# Altium project Portable_power_supply_v1.PrjPcb
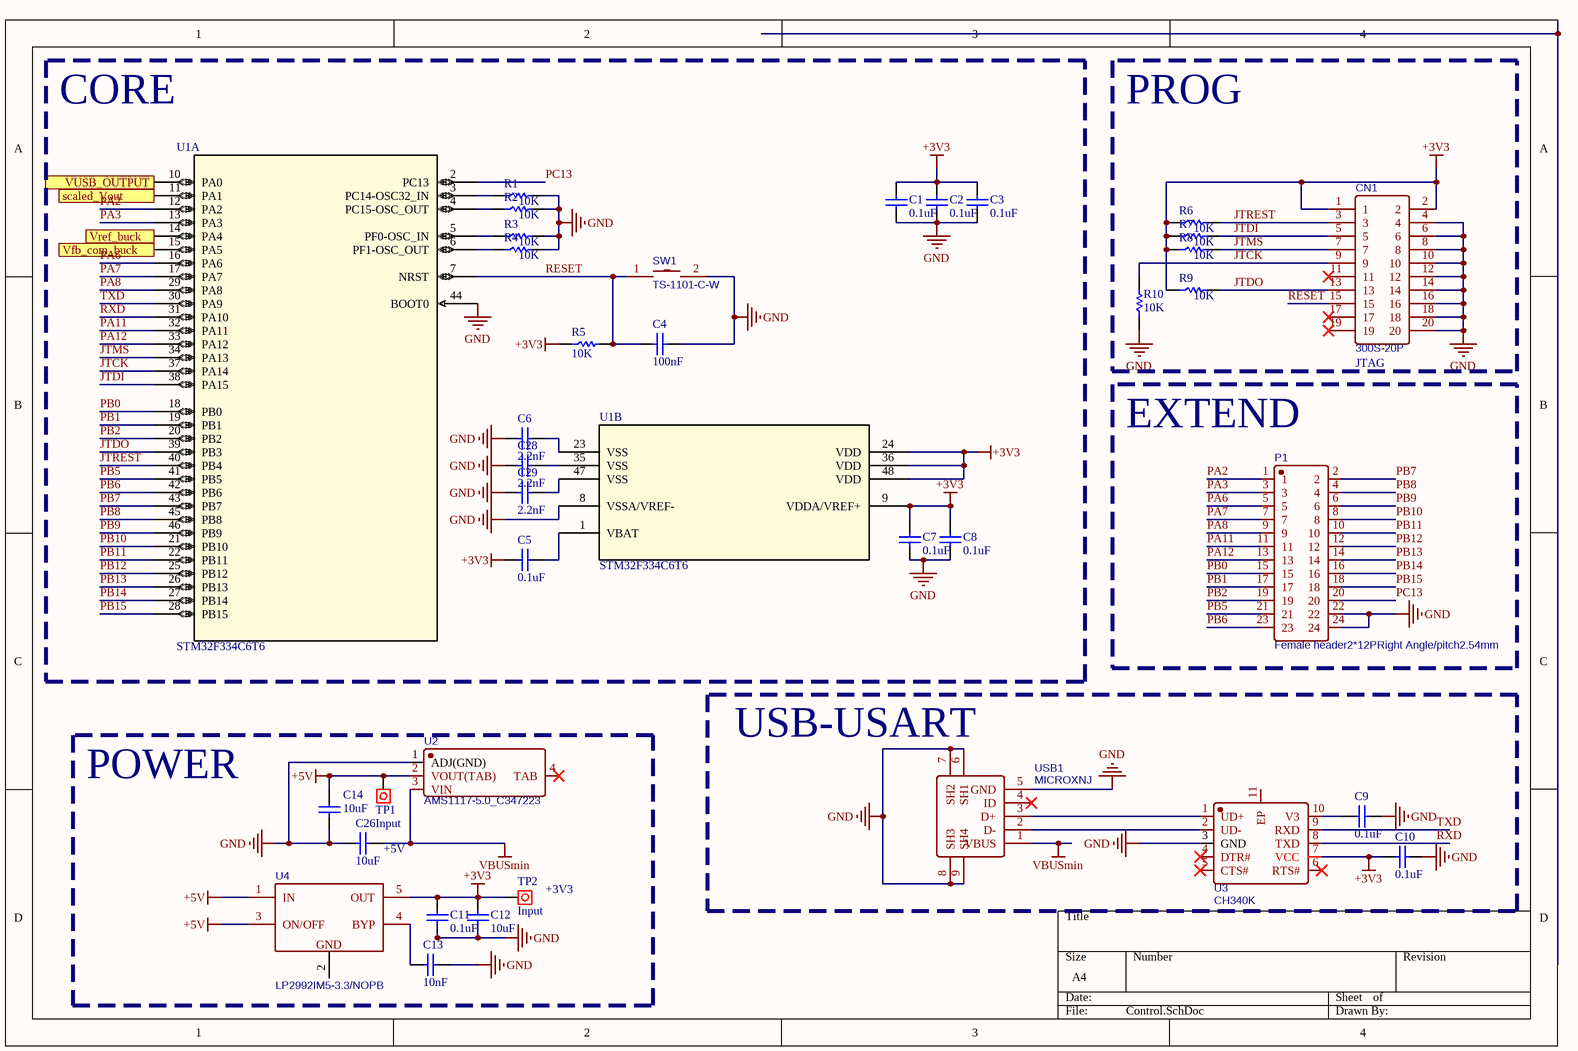
[diagram p0: Control.SchDoc]
4 sheets, 111 parts. Net scope: flat (ports and power ports of the same name join across sheets).
Board file: Portable power supply version2.PcbDoc
Sheets:
  Control.SchDoc
  Front(LDR).SchDoc
  BoostRegulator.SchDoc
  Buck_CurrentRegulator.SchDoc

## Sheet Control.SchDoc
size A4; SheetNumber: 1; SheetTotal: 4

### Parts
C1  0.1uF  [0805C]
C2  0.1uF  [0805C]
C3  0.1uF  [0805C]
C4  100nF  [0805C]
C5  0.1uF  [0805C]
C6  2.2nF  [0805C]
C7  0.1uF  [0805C]
C8  0.1uF  [0805C]
C9  0.1uF  [0805C]
C10  0.1uF  [0805C]
C11  0.1uF  [0805C]
C12  10uF  [0805C]
C13  10nF  [0805C]
C14  10uF  [0805C]
C26  10uF  [0805C]
C28  2.2nF  [0805C]
C29  2.2nF  [0805C]
CN1  300S-20P  [CONN-TH_300S-20P]
P1  Female header2*12PRight Angle/pitch2.54mm  [HDR-TH_24P-P2.54-V-F-R2-C12-S2.54]
R1  10K  [0805]
R2  10K  [0805]
R3  10K  [0805]
R4  10K  [0805]
R5  10K  [0805]
R6  10K  [0805]
R7  10K  [0805]
R8  10K  [0805]
R9  10K  [0805]
R10  10K  [0805]
SW1  TS-1101-C-W  [SW-SMD_L6.0-W3.3-LS8.0]
TP1  INPUT  [Testpoin]
TP2  INPUT  [Testpoin]
U1  STM32F334C6T6  [LQFP48-7x7mm]  (parts A,B of 2)
U2  AMS1117-5.0_C347223  [SOT-223_L6.7-W3.5-P2.30-BR]
U3  CH340K  [ESOP-10_L4.9-W3.9-P1.00-LS6.2-BL-EP]
U4  LP2992IM5-3.3/NOPB  [SOT-23-5_L3.0-W1.7-P0.95-LS2.8-BR]
USB1  MICROXNJ  [MICRO-USB-SMD_MICROXNJ]

### Blocks framed on the sheet
CORE: C1-C8 C28 C29 R1-R5 SW1 U1
PROG: CN1 R6-R10
EXTEND: P1
POWER: C11-C14 C26 TP1 TP2 U2 U4
USB-USART: C9 C10 U3 USB1

### Ports
scaled_Vout (in), Vfb_com_buck (out), Vref_buck (out), VUSB_OUTPUT (in)

### Nets
+3V3: C1.1 C2.1 C3.1 C5.2 C7.1 C8.1 C10.2 C11.1 C12.1 CN1.1 CN1.2 R5.1 R6.1 R7.1 R8.1 R9.1 TP2.1 U1.9(VDDA/VREF+) U1.24(VDD) U1.36(VDD) U1.48(VDD) U3.7(VCC) U4.5(OUT)
+5V: C14.1 TP1.1 U2.2(VOUT(TAB)) U4.1(IN) U4.3(ON/OFF)
GND: C1.2 C2.2 C3.2 C4.1 C6.2 C7.2 C8.2 C9.2 C10.1 C11.2 C12.2 C13.1 C14.2 C26.2 C28.2 C29.2 CN1.4 CN1.6 CN1.8 CN1.10 CN1.12 CN1.14 CN1.16 CN1.18 CN1.20 P1.22 P1.24 R1.2 R2.2 R3.2 R4.2 R10.1 SW1.2 U1.8(VSSA/VREF-) U1.44(BOOT0) U2.1(ADJ(GND)) U3.3(GND) USB1.5(GND) USB1.6(SH1) USB1.7(SH2) USB1.8(SH3) USB1.9(SH4)
VBUSmin: C26.1 U2.3(VIN) USB1.1(VBUS)
JTCK: CN1.9 R10.2 U1.37(PA14)
JTDI: CN1.5 R7.2 U1.38(PA15)
JTDO: CN1.13 R9.2 U1.39(PB3)
JTMS: CN1.7 R8.2 U1.34(PA13)
JTREST: CN1.3 R6.2 U1.40(PB4)
PA2: P1.1 U1.12(PA2)
PA3: P1.3 U1.13(PA3)
PA6: P1.5 U1.16(PA6)
PA7: P1.7 U1.17(PA7)
PA8: P1.9 U1.29(PA8)
PA11: P1.11 U1.32(PA11)
PA12: P1.13 U1.33(PA12)
PB0: P1.15 U1.18(PB0)
PB1: P1.17 U1.19(PB1)
PB2: P1.19 U1.20(PB2)
PB5: P1.21 U1.41(PB5)
PB6: P1.23 U1.42(PB6)
PB7: P1.2 U1.43(PB7)
PB8: P1.4 U1.45(PB8)
PB9: P1.6 U1.46(PB9)
PB10: P1.8 U1.21(PB10)
PB11: P1.10 U1.22(PB11)
PB12: P1.12 U1.25(PB12)
PB13: P1.14 U1.26(PB13)
PB14: P1.16 U1.27(PB14)
PB15: P1.18 U1.28(PB15)
PC13: P1.20 U1.2(PC13)
RESET: C4.2 CN1.15 R5.2 SW1.1 U1.7(NRST)
RXD: U1.31(PA10) U3.8(TXD)
TXD: U1.30(PA9) U3.9(RXD)
NetC5_1: C5.1 U1.1(VBAT)
NetC6_1: C6.1 U1.23(VSS)
NetC9_1: C9.1 U3.10(V3)
NetC13_2: C13.2 U4.4(BYP)
NetC27_2: U1.10(PA0) ; port VUSB_OUTPUT
NetC28_1: C28.1 U1.35(VSS)
NetC29_1: C29.1 U1.47(VSS)
NetR1_1: R1.1 U1.3(PC14-OSC32_IN)
NetR2_1: R2.1 U1.4(PC15-OSC_OUT)
NetR3_1: R3.1 U1.5(PF0-OSC_IN)
NetR4_1: R4.1 U1.6(PF1-OSC_OUT)
NetR35_2: U1.14(PA4) ; port Vref_buck
NetU1_11: U1.11(PA1) ; port scaled_Vout
NetU1_15: U1.15(PA5) ; port Vfb_com_buck
NetU3_1: U3.1(UD+) USB1.3(D+)
NetU3_2: U3.2(UD-) USB1.2(D-)

Not connected (* = marked no-connect by the designer): CN1 11* 17* 19*; U2 4(TAB)*; U3 4(DTR#)* 5(CTS#)* 6(RTS#)* 11(EP); U4 2(GND); USB1 4(ID)*

### Notes on the sheet
- (near CN1) JTAG
- (near C26) +5V
- (near TP2) +3V3

### Library data of the parts
C1-C3 C5 C7-C11 = C_0.1uf: Capacitor; Reviewed by: RM - 2018/08/05; Revision: July-2002: Re-released for DXP Platform.; Supplier 1: *; Supplier Part Number 1: *; Value: 0.1uF
C4 = C_100nf: Capacitor; Reviewed by: RM - 2018/08/05; Revision: July-2002: Re-released for DXP Platform.; Supplier 1: *; Supplier Part Number 1: *; Value: 100nF
C6 C28 C29 = C_2.2nF: Capacitor; Reviewed by: RM - 2018/08/05; Revision: July-2002: Re-released for DXP Platform.; Supplier 1: *; Supplier Part Number 1: *; Value: 2.2nF
C12 C14 C26 = C_10uf: Capacitor; Reviewed by: RM - 2018/08/05; Revision: July-2002: Re-released for DXP Platform.; Supplier 1: *; Supplier Part Number 1: *; Value: 10uF
C13 = C_10nF: Capacitor; Reviewed by: RM - 2018/08/05; Revision: July-2002: Re-released for DXP Platform.; Supplier 1: *; Supplier Part Number 1: *; Value: 10nF
CN1 = 300S-20P: BOM_Manufacturer: Shenzhen Cankemeng; Contributor: LCSC; BOM_Supplier: LCSC; BOM_Supplier Part: C132442; BOM_Manufacturer Part: -; BOM_JLCPCB Part Class: Extended Part; spicePre: C; spiceSymbolName: 300S-20P
P1 = Female header2*12PRight Angle/pitch2.54mm: BOM_Manufacturer: BOOMELE; BOM_Supplier: LCSC; BOM_Manufacturer Part: Female header2*12PRight Angle/pitch2.54mm; BOM_Supplier Part: C62744; BOM_JLCPCB Part Class: Extended Part; spicePre: P; spiceSymbolName: Female header2*12PRight Angle/pitch2.54mm
R1-R10 = R_10k: Resistor; Reviewed by: RM - 2018/08/05; Supplier 1: *; Suppler Part Number 1: *; Value: 10K
SW1 = TS-1101-C-W: BOM_Manufacturer: XKB Connectivity(中国星坤); Contributor: LCSC; BOM_Supplier: LCSC; BOM_Supplier Part: C318938; BOM_Manufacturer Part: TS-1101-C-W; BOM_JLCPCB Part Class: Extended Part; spicePre: S; spiceSymbolName: TS-1101-C-W
TP1 TP2 = Test Point: Pad; Value: Input
U1 = STM32F334C6T6: No Description Available; Mfr_Name: STMicroelectronics; Copyright: Copyright (C) 2021 Ultra Librarian. All rights reserved.; Manufacturer_Part_Number: STM32F334C6T6; RefDes: RefDes; Type: DEV
U2 = AMS1117-5.0_C347223: BOM_Manufacturer: Youtai Semiconductor Co., Ltd.; Contributor: LCSC; BOM_Supplier: LCSC; BOM_Supplier Part: C347223; BOM_Manufacturer Part: AMS1117-5.0; BOM_JLCPCB Part Class: Extended Part; spicePre: U; spiceSymbolName: AMS1117-5.0_C347223
U3 = CH340K: BOM_Manufacturer: WCH(Jiangsu Qin Heng); Contributor: LCSC; BOM_Supplier: LCSC; BOM_Supplier Part: C968586; BOM_Manufacturer Part: CH340K; BOM_JLCPCB Part Class: Extended Part; spicePre: U; spiceSymbolName: CH340K
U4 = LP2992IM5-3.3/NOPB: BOM_Manufacturer: TI; Contributor: LCSC; BOM_Supplier: LCSC; BOM_Manufacturer Part: LP2992IM5-3.3/NOPB; BOM_Supplier Part: C129353; BOM_JLCPCB Part Class: Extended Part; spicePre: U; spiceSymbolName: LP2992IM5-3.3/NOPB
USB1 = MICROXNJ: BOM_Manufacturer: SHOU HAN; Contributor: LCSC; BOM_Supplier: LCSC; BOM_Supplier Part: C404969; BOM_Manufacturer Part: MicroXNJ; BOM_JLCPCB Part Class: Extended Part; spicePre: U; spiceSymbolName: MICROXNJ

## Sheet Front(LDR).SchDoc
size A4; SheetNumber: 2; SheetTotal: 4
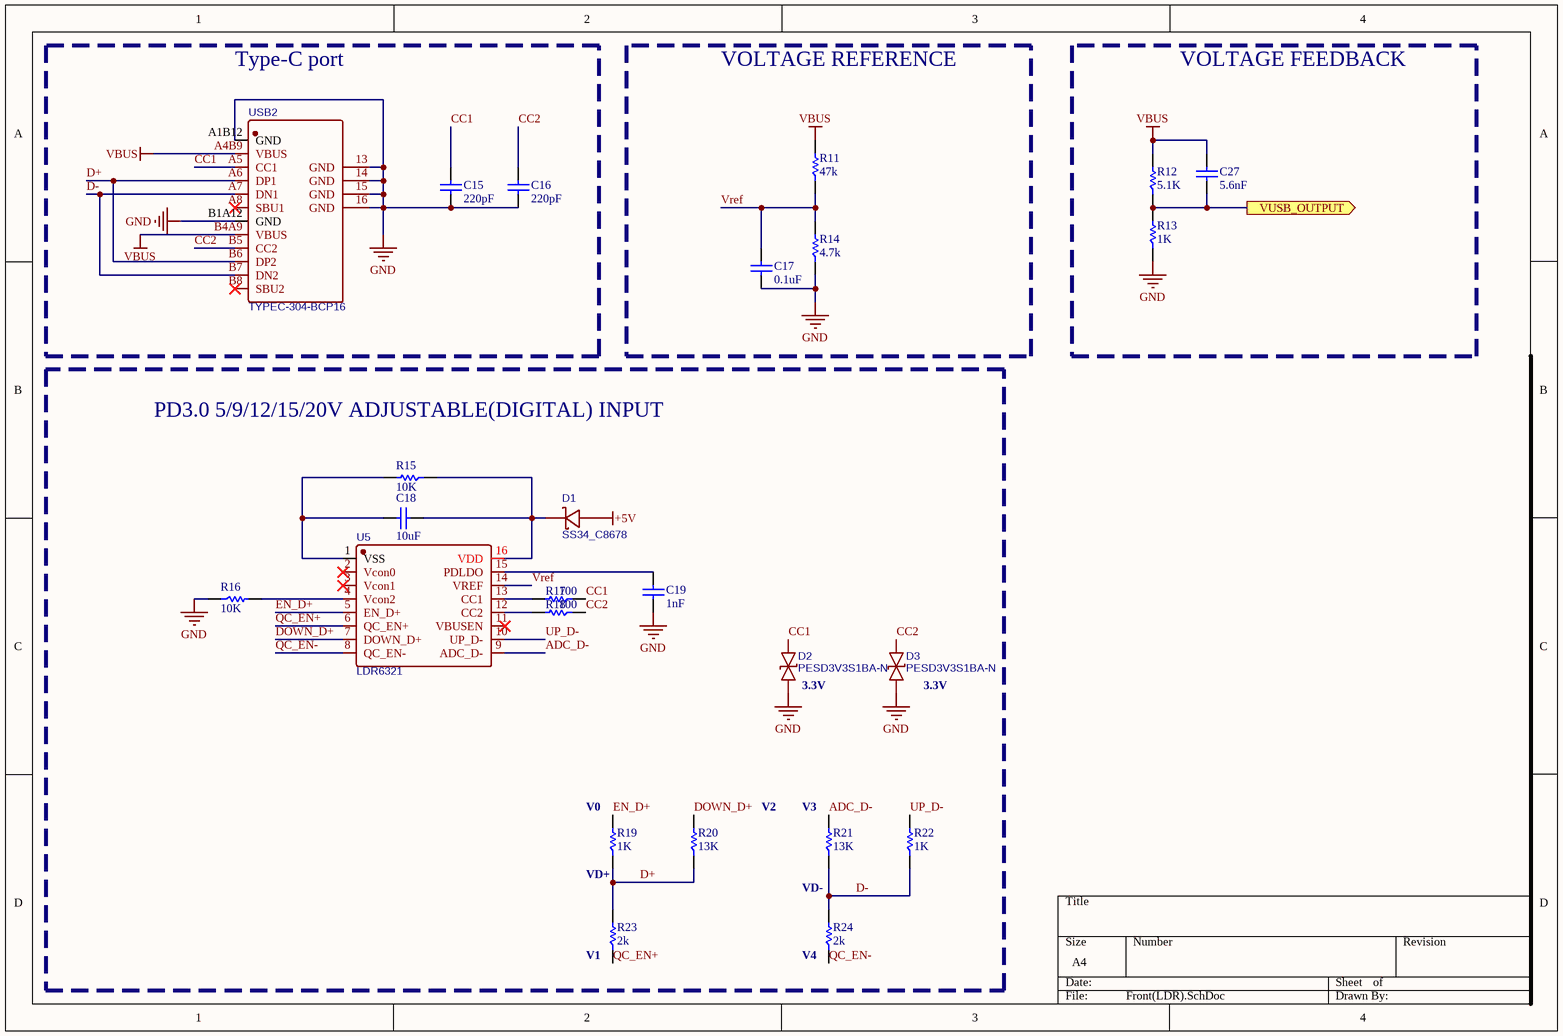
[diagram p1: Front(LDR).SchDoc]

### Parts
C15  220pF  [0805C]
C16  220pF  [0805C]
C17  0.1uF  [0805C]
C18  10uF  [0805C]
C19  1nF  [0805C]
C27  5.6nF  [0805C]
D1  SS34_C8678  [DO-214AC_L4.3-W2.7-LS5.3-RD]
D2  PESD3V3S1BA-N  [SOD-523_L1.2-W0.8-LS1.6-BI]
D3  PESD3V3S1BA-N  [SOD-523_L1.2-W0.8-LS1.6-BI]
R11  47k  [0805]
R12  5.1K  [0805]
R13  1K  [0805]
R14  4.7k  [0805]
R15  10K  [0805]
R16  10K  [0805]
R17  100  [0805]
R18  100  [0805]
R19  1K  [0805]
R20  13K  [0805]
R21  13K  [0805]
R22  1K  [0805]
R23  2k  [0805]
R24  2k  [0805]
U5  LDR6321  [SSOP-16_L5.0-W4.4-P0.65-LS6.4-BL]
USB2  TYPEC-304-BCP16  [USB-C-SMD_TYPEC-304-BCP16]

### Blocks framed on the sheet
Type-C port: C15 C16 USB2
VOLTAGE REFERENCE: C17 R11 R14
VOLTAGE FEEDBACK: C27 R12 R13
PD3.0 5/9/12/15/20V ADJUSTABLE(DIGITAL) INPUT: C18 C19 D1-D3 R15-R24 U5

### Ports
VUSB_OUTPUT (out)

### Nets
+5V: D1.2(A)
GND: C15.2 C16.2 C17.2 C19.2 D2.1 D3.1 R13.1 R14.1 R16.1 USB2.13(GND) USB2.14(GND) USB2.15(GND) USB2.16(GND) USB2.A1B12(GND) USB2.B1A12(GND)
VBUS: C27.1 R11.2 R12.2 USB2.A4B9(VBUS) USB2.B4A9(VBUS)
ADC_D-: R21.2 U5.9(ADC_D-)
CC1: C15.1 D2.2 R17.1 USB2.A5(CC1)
CC2: C16.1 D3.2 R18.1 USB2.B5(CC2)
D+: R19.1 R20.1 R23.2 USB2.A6(DP1) USB2.B6(DP2)
D-: R21.1 R22.1 R24.2 USB2.A7(DN1) USB2.B7(DN2)
DOWN_D+: R20.2 U5.7(DOWN_D+)
EN_D+: R19.2 U5.5(EN_D+)
QC_EN+: R23.1 U5.6(QC_EN+)
QC_EN-: R24.1 U5.8(QC_EN-)
UP_D-: R22.2 U5.10(UP_D-)
Vref: C17.1 R11.1 R14.2 U5.14(VREF)
NetC18_1: C18.1 R15.2 U5.1(VSS)
NetC18_2: C18.2 D1.1(K) R15.1 U5.16(VDD)
NetC19_1: C19.1 U5.15(PDLDO)
NetC27_2: C27.2 R12.1 R13.2 ; port VUSB_OUTPUT
NetR16_2: R16.2 U5.4(Vcon2)
NetR17_2: R17.2 U5.13(CC1)
NetR18_2: R18.2 U5.12(CC2)

Not connected (* = marked no-connect by the designer): U5 2(Vcon0)* 3(Vcon1)* 11(VBUSEN)*; USB2 A8(SBU1)* B8(SBU2)*

### Notes on the sheet
- (near D2) 3.3V
- (near D3) 3.3V
- (near R19) V0
- V2
- (near R21) V3
- (near R19) VD+
- VD-
- (near R23) V1
- (near R24) V4

### Library data of the parts
C15 C16 = C_220pF: Capacitor; Reviewed by: RM - 2018/08/05; Revision: July-2002: Re-released for DXP Platform.; Supplier 1: *; Supplier Part Number 1: *; Value: 220pF
C17 = C_0.1uf: Capacitor; Reviewed by: RM - 2018/08/05; Revision: July-2002: Re-released for DXP Platform.; Supplier 1: *; Supplier Part Number 1: *; Value: 0.1uF
C18 = C_10uf: Capacitor; Reviewed by: RM - 2018/08/05; Revision: July-2002: Re-released for DXP Platform.; Supplier 1: *; Supplier Part Number 1: *; Value: 10uF
C19 = C_1nf: Capacitor; Reviewed by: RM - 2018/08/05; Revision: July-2002: Re-released for DXP Platform.; Supplier 1: *; Supplier Part Number 1: *; Value: 1nF
C27 = C_5.6nf: Capacitor; Reviewed by: RM - 2018/08/05; Revision: July-2002: Re-released for DXP Platform.; Supplier 1: *; Supplier Part Number 1: *; Value: 5.6nF
D1 = SS34_C8678: BOM_Manufacturer Part: SS34; BOM_Manufacturer: MDD; BOM_Supplier: LCSC; BOM_Supplier Part: C8678; BOM_JLCPCB Part Class: Basic Part; spicePre: D; spiceSymbolName: SS34_C8678
D2 D3 = PESD3V3S1BA-N: TVS3V3; BOM_Manufacturer: Bourne Semicon (Shenzhen); Contributor: LCSC; BOM_Supplier: LCSC; BOM_Supplier Part: C316037; BOM_Manufacturer Part: PESD3V3S1BA-N; BOM_JLCPCB Part Class: Extended Part; spicePre: D; spiceSymbolName: PESD3V3S1BA-N
R11 = R_47k: Resistor; Reviewed by: RM - 2018/08/05; Supplier 1: *; Suppler Part Number 1: *; Value: 47k
R12 = R_5.1k: Resistor; Reviewed by: RM - 2018/08/05; Supplier 1: *; Suppler Part Number 1: *; Value: 5.1K
R13 R19 R22 = R_1k: Resistor; Reviewed by: RM - 2018/08/05; Supplier 1: *; Suppler Part Number 1: *; Value: 1K
R14 = R_4.7k: Resistor; Reviewed by: RM - 2018/08/05; Supplier 1: *; Suppler Part Number 1: *; Value: 4.7k
R15 R16 = R_10k: Resistor; Reviewed by: RM - 2018/08/05; Supplier 1: *; Suppler Part Number 1: *; Value: 10K
R17 R18 = R_100: Resistor; Reviewed by: RM - 2018/08/05; Supplier 1: *; Suppler Part Number 1: *; Value: 100
R20 R21 = R_13k: Resistor; Reviewed by: RM - 2018/08/05; Supplier 1: *; Suppler Part Number 1: *; Value: 13K
R23 R24 = R_2k: Resistor; Reviewed by: RM - 2018/08/05; Supplier 1: *; Suppler Part Number 1: *; Value: 2k
U5 = LDR6321: BOM_Manufacturer: Legendary(乐得瑞); Contributor: LCSC; BOM_Supplier: LCSC; BOM_Supplier Part: C2919632; BOM_Manufacturer Part: LDR6321; BOM_JLCPCB Part Class: Extended Part; spicePre: U; spiceSymbolName: LDR6321
USB2 = TYPEC-304-BCP16: BOM_Manufacturer: XUNPU; Contributor: LCSC; BOM_Supplier: LCSC; BOM_Supplier Part: C720629; BOM_Manufacturer Part: TYPEC-304-BCP16; BOM_JLCPCB Part Class: Extended Part; spicePre: U; spiceSymbolName: TYPEC-304-BCP16

## Sheet BoostRegulator.SchDoc
size A4; SheetNumber: 3; SheetTotal: 4
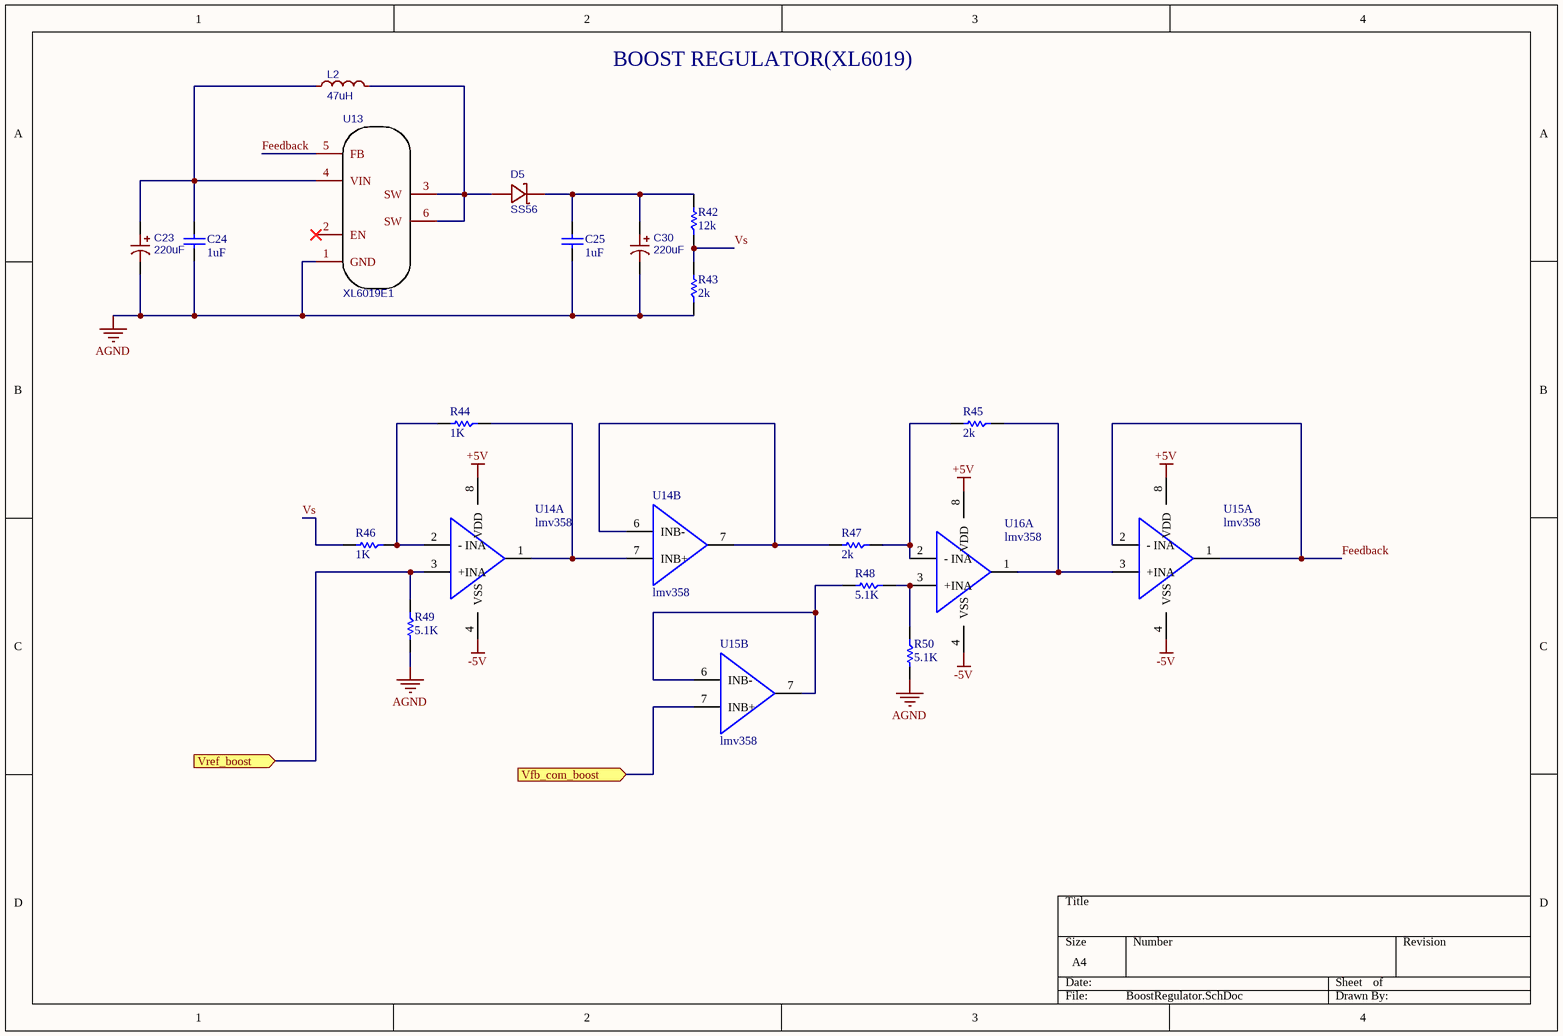
[diagram p2: BoostRegulator.SchDoc]

### Parts
C23  220uF  [CAP-SMD_BD10.0-L10.3-W10.3-LS11.0-FD]
C24  1uF  [0805C]
C25  1uF  [0805C]
C30  220uF  [CAP-SMD_BD10.0-L10.3-W10.3-LS11.0-FD]
D5  SS56  [SMA_L4.3-W2.6-LS5.2-RD]
L2  47uH  [IND-SMD_L12.6-W12.6_MCF-13XX]
R42  12k  [0805]
R43  2k  [0805]
R44  1K  [0805]
R45  2k  [0805]
R46  1K  [0805]
R47  2k  [0805]
R48  5.1K  [0805]
R49  5.1K  [0805]
R50  5.1K  [0805]
U13  XL6019E1  [TO-263-5_L10.2-W9.9-P1.70-LS14.4-TL]
U14  lmv358  [SOP-8_L4.9-W3.9-P1.27-LS6.0-BL]  (parts A,B of 2)
U15  lmv358  [SOP-8_L4.9-W3.9-P1.27-LS6.0-BL]  (parts A,B of 2)
U16  lmv358  [SOP-8_L4.9-W3.9-P1.27-LS6.0-BL]  (part A of 2)

### Ports
Vfb_com_boost (in), Vref_boost (in)

### Nets
+5V: U14.8(VDD) U15.8(VDD) U16.8(VDD)
-5V: U14.4(VSS) U15.4(VSS) U16.4(VSS)
AGND: C23.2 C24.2 C25.2 C30.2 R43.1 R49.2 R50.2 U13.1(GND)
Feedback: U13.5(FB) U15.1(OUTA) U15.2(-_INA)
Vs: R42.1 R43.2 R46.2
NetC23_1: C23.1 C24.1 L2.1 U13.4(VIN)
NetC25_1: C25.1 C30.1 D5.1(K) R42.2
NetD5_2: D5.2(A) L2.2 U13.3(SW) U13.6(SW)
NetR44_1: R44.1 U14.1(OUTA) U14.7(INB+)
NetR44_2: R44.2 R46.1 U14.2(-_INA)
NetR45_1: R45.1 U15.3(+INA) U16.1(OUTA)
NetR45_2: R45.2 R47.1 U16.2(-_INA)
NetR47_2: R47.2 U14.6(INB-) U14.7(OUTB)
NetR48_1: R48.1 R50.1 U16.3(+INA)
NetR48_2: R48.2 U15.6(INB-) U15.7(OUTB)
NetR49_1: R49.1 U14.3(+INA) ; port Vref_boost
NetU15_7: U15.7(INB+) ; port Vfb_com_boost

Not connected (* = marked no-connect by the designer): U13 2(EN)*

### Notes on the sheet
- BOOST REGULATOR(XL6019)

### Library data of the parts
C23 C30 = 220uF: BOM_Manufacturer: KNSCHA(科尼盛); BOM_Manufacturer Part: RVT220UF50V67RV0021; nameAlias: Capacitance; Contributor: LCSC; BOM_Supplier: LCSC; BOM_Supplier Part: C2887271; BOM_JLCPCB Part Class: Extended Part; spicePre: C; spiceSymbolName: RVT220UF50V67RV0021
C24 C25 = C_1uf: Capacitor; Reviewed by: RM - 2018/08/05; Revision: July-2002: Re-released for DXP Platform.; Supplier 1: *; Supplier Part Number 1: *; Value: 1uF
D5 = SS56: BOM_Manufacturer: MDD; BOM_Supplier: LCSC; BOM_Manufacturer Part: SS56; BOM_Supplier Part: C65009; BOM_JLCPCB Part Class: Extended Part; spicePre: D; spiceSymbolName: SS56
L2 = 47uH: BOM_Manufacturer: YJYCOIN; BOM_Manufacturer Part: YSPI1365-470M; nameAlias: Inductance; Contributor: LCSC; BOM_Supplier: LCSC; BOM_Supplier Part: C497913; BOM_JLCPCB Part Class: Extended Part; spicePre: L; spiceSymbolName: YSPI1365-470M
R42 = R_12k: Resistor; Reviewed by: RM - 2018/08/05; Supplier 1: *; Suppler Part Number 1: *; Value: 12k
R43 = R_2k: Resistor; Reviewed by: RM - 2018/08/05; Supplier 1: *; Suppler Part Number 1: *; Value: 2k
R44 R46 = R_6: Resistor; Reviewed by: RM - 2018/08/05; Supplier 1: *; Suppler Part Number 1: *; Value: 1K
R45 R47 = R_3: Resistor; Reviewed by: RM - 2018/08/05; Supplier 1: *; Suppler Part Number 1: *; Value: 2k
R48-R50 = R_1: Resistor; Reviewed by: RM - 2018/08/05; Supplier 1: *; Suppler Part Number 1: *; Value: 5.1K
U13 = XL6019E1: BOM_Manufacturer: XLSEMI; BOM_Supplier: LCSC; BOM_Manufacturer Part: XL6019E1; BOM_Supplier Part: C73018; BOM_JLCPCB Part Class: Extended Part; spicePre: U; spiceSymbolName: XL6019E1
U14-U16 = LMV358-SR: OpAmp High Frequency Dual; Reviewed by: RM - 2018/08/05

## Sheet Buck_CurrentRegulator.SchDoc
size A4; SheetNumber: 4; SheetTotal: 4
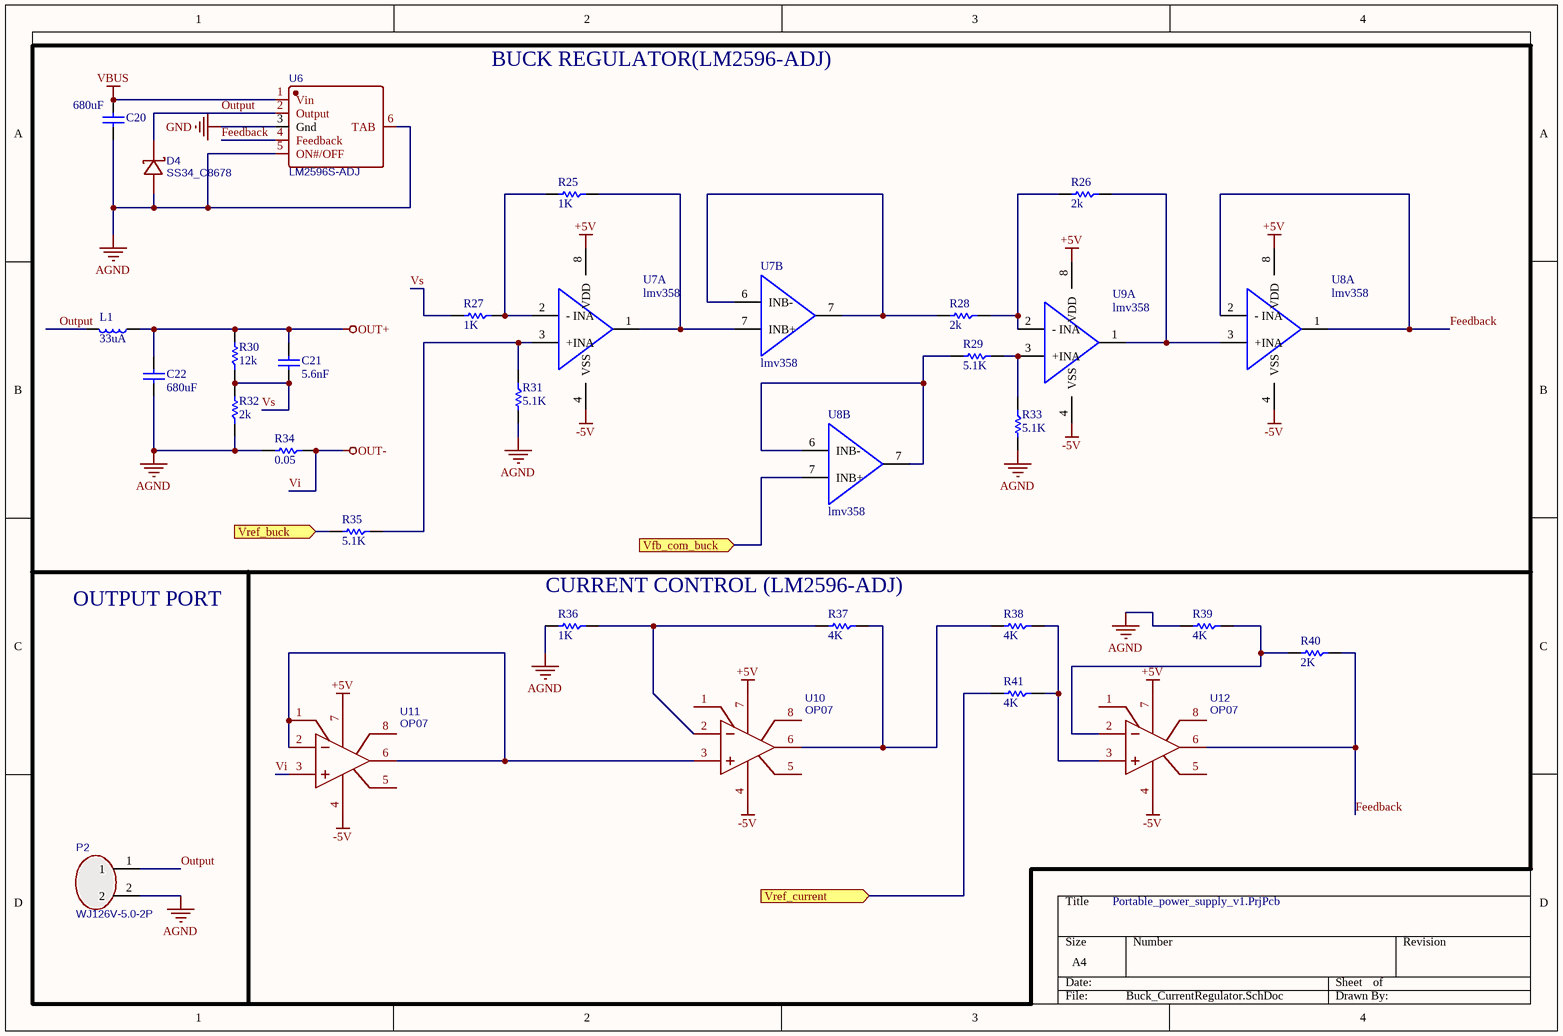
[diagram p3: Buck_CurrentRegulator.SchDoc]

### Parts
C20  680uF  [0805C]
C21  5.6nF  [0805C]
C22  680uF  [0805C]
D4  SS34_C8678  [DO-214AC_L4.3-W2.7-LS5.3-RD]
L1  33uA  [0805]
P2  WJ126V-5.0-2P  [CONN-TH_WJ126V-5.0-2P]
R25  1K  [0805]
R26  2k  [0805]
R27  1K  [0805]
R28  2k  [0805]
R29  5.1K  [0805]
R30  12k  [0805]
R31  5.1K  [0805]
R32  2k  [0805]
R33  5.1K  [0805]
R34  0.05  [0805]
R35  5.1K  [0805]
R36  1K  [0805]
R37  4K  [0805]
R38  4K  [0805]
R39  4K  [0805]
R40  2K  [0805]
R41  4K  [0805]
U6  LM2596S-ADJ  [TO-263-5_L10.2-W8.9-P1.70-BR]
U7  lmv358  [SOP-8_L4.9-W3.9-P1.27-LS6.0-BL]  (parts A,B of 2)
U8  lmv358  [SOP-8_L4.9-W3.9-P1.27-LS6.0-BL]  (parts A,B of 2)
U9  lmv358  [SOP-8_L4.9-W3.9-P1.27-LS6.0-BL]  (part A of 2)
U10  OP07  [SOP-8_L4.9-W3.9-P1.27-LS6.0-BL]
U11  OP07  [SOP-8_L4.9-W3.9-P1.27-LS6.0-BL]
U12  OP07  [SOP-8_L4.9-W3.9-P1.27-LS6.0-BL]

### Blocks framed on the sheet
BUCK REGULATOR(LM2596-ADJ): C20-C22 D4 L1 R25-R35 U6-U9

### Ports
Vfb_com_buck (in), Vref_buck (in), Vref_current (in)

### Nets
+5V: U7.8(VDD) U8.8(VDD) U9.8(VDD) U10.7(V+) U11.7(V+) U12.7(V+)
-5V: U7.4(VSS) U8.4(VSS) U9.4(VSS) U10.4(V-) U11.4(V-) U12.4(V-)
AGND: C20.2 C22.1 D4.2(A) P2.2 R31.2 R32.1 R33.2 R34.2 R36.2 R39.2 U6.5(ON#/OFF) U6.6(TAB)
GND: U6.3(Gnd)
OUT+: C21.1 C22.2 L1.1 R30.2
VBUS: C20.1 U6.1(Vin)
Vi: R34.1 U11.3(IN+)  [also labelled OUT-]
Feedback: R40.1 U6.4(Feedback) U8.1(OUTA) U8.2(-_INA) U12.6(OUT)
Output: D4.1(K) L1.2 P2.1 U6.2(Output)
Vs: C21.2 R27.2 R30.1 R32.2
NetR25_1: R25.1 U7.1(OUTA) U7.7(INB+)
NetR25_2: R25.2 R27.1 U7.2(-_INA)
NetR26_1: R26.1 U8.3(+INA) U9.1(OUTA)
NetR26_2: R26.2 R28.1 U9.2(-_INA)
NetR28_2: R28.2 U7.6(INB-) U7.7(OUTB)
NetR29_1: R29.1 R33.1 U9.3(+INA)
NetR29_2: R29.2 U8.6(INB-) U8.7(OUTB)
NetR31_1: R31.1 R35.1 U7.3(+INA)
NetR35_2: R35.2 ; port Vref_buck
NetR36_1: R36.1 R37.2 U10.2(IN-)
NetR37_1: R37.1 R38.2 U10.6(OUT)
NetR38_1: R38.1 R41.1 U12.3(IN+)
NetR39_1: R39.1 R40.2 U12.2(IN-)
NetR41_2: R41.2 ; port Vref_current
NetU1_15: U8.7(INB+) ; port Vfb_com_buck
NetU10_3: U10.3(IN+) U11.1(VOS_TRIM) U11.2(IN-) U11.6(OUT)

Not connected (* = marked no-connect by the designer): U10 1(VOS_TRIM) 5(NC) 8(VOS_TRIM); U11 5(NC) 8(VOS_TRIM); U12 1(VOS_TRIM) 5(NC) 8(VOS_TRIM)

### Notes on the sheet
- OUTPUT PORT
- CURRENT CONTROL (LM2596-ADJ)

### Library data of the parts
C20 = C_680uf: Capacitor; Reviewed by: RM - 2018/08/05; Revision: July-2002: Re-released for DXP Platform.; Supplier 1: *; Supplier Part Number 1: *; Value: 680uF
C21 = C_7: Capacitor; Reviewed by: RM - 2018/08/05; Revision: July-2002: Re-released for DXP Platform.; Supplier 1: *; Supplier Part Number 1: *; Value: 5.6nF
C22 = C_11: Capacitor; Reviewed by: RM - 2018/08/05; Revision: July-2002: Re-released for DXP Platform.; Supplier 1: *; Supplier Part Number 1: *; Value: 680uF
D4 = SS34_C8678: as D1 on sheet Front(LDR); BOM_Supplier: LCSC; BOM_Supplier Part: C8678; BOM_JLCPCB Part Class: Basic Part; spicePre: D; spiceSymbolName: SS34_C8678
L1 = I: Inductor; Reviewed by: RM - 2018/08/05; Supplier 1: *; Supplier Part Number 1: *; Value: 33uA
P2 = WJ126V-5.0-2P: BOM_Manufacturer: ReliaPro; BOM_Supplier: LCSC; BOM_Manufacturer Part: WJ126V-5.0-2P; BOM_Supplier Part: C8404; BOM_JLCPCB Part Class: Extended Part; spicePre: P; spiceSymbolName: WJ126V-5.0-2P
R25 R27 R34 = R_6: Resistor; Reviewed by: RM - 2018/08/05; Supplier 1: *; Suppler Part Number 1: *
  R25 R27: Value: 1K
  R34: Value: 0.05
R26 R28 R32 = R_3: Resistor; Reviewed by: RM - 2018/08/05; Supplier 1: *; Suppler Part Number 1: *; Value: 2k
R29 R31 R33 R35 = R_1: Resistor; Reviewed by: RM - 2018/08/05; Supplier 1: *; Suppler Part Number 1: *; Value: 5.1K
R30 = R_2: Resistor; Reviewed by: RM - 2018/08/05; Supplier 1: *; Suppler Part Number 1: *; Value: 12k
R36-R41 = R_1k: Resistor; Reviewed by: RM - 2018/08/05; Supplier 1: *; Suppler Part Number 1: *
  R36: Value: 1K
  R37-R39 R41: Value: 4K
  R40: Value: 2K
U6 = LM2596S-ADJ: BOM_Manufacturer: UMW(Youtai Semiconductor Co., Ltd.); Contributor: LCSC; BOM_Supplier: LCSC; BOM_Supplier Part: C347423; BOM_Manufacturer Part: LM2596S-ADJ; BOM_JLCPCB Part Class: Extended Part; spicePre: U; spiceSymbolName: LM2596S-ADJ
U7-U9 = LMV358-SR: as U14 on sheet BoostRegulator
U10-U12 = OP07: BOM_Manufacturer: Hangzhou Ruimeng Tech; Contributor: LCSC; BOM_Supplier: LCSC; BOM_Supplier Part: C1508997; BOM_Manufacturer Part: OP07; BOM_JLCPCB Part Class: Extended Part; spicePre: U; spiceSymbolName: OP07

## Nets that join several sheets
+5V: Control (5 pins), Front(LDR) (D1.2), BoostRegulator (U14.8 U15.8 U16.8), Buck_CurrentRegulator (6 pins)
-5V: BoostRegulator (U14.4 U15.4 U16.4), Buck_CurrentRegulator (6 pins)
AGND: BoostRegulator (8 pins), Buck_CurrentRegulator (12 pins)
GND: Control (42 pins), Front(LDR) (15 pins), Buck_CurrentRegulator (U6.3)
VBUS: Front(LDR) (5 pins), Buck_CurrentRegulator (C20.1 U6.1)
NetC27_2: Control (U1.10), Front(LDR) (C27.2 R12.1 R13.2)
NetR35_2: Control (U1.14), Buck_CurrentRegulator (R35.2)
NetU1_15: Control (U1.15), Buck_CurrentRegulator (U8.7)